# EAGLE design cc2538-dev-v1 (EAGLE 6.5.0)
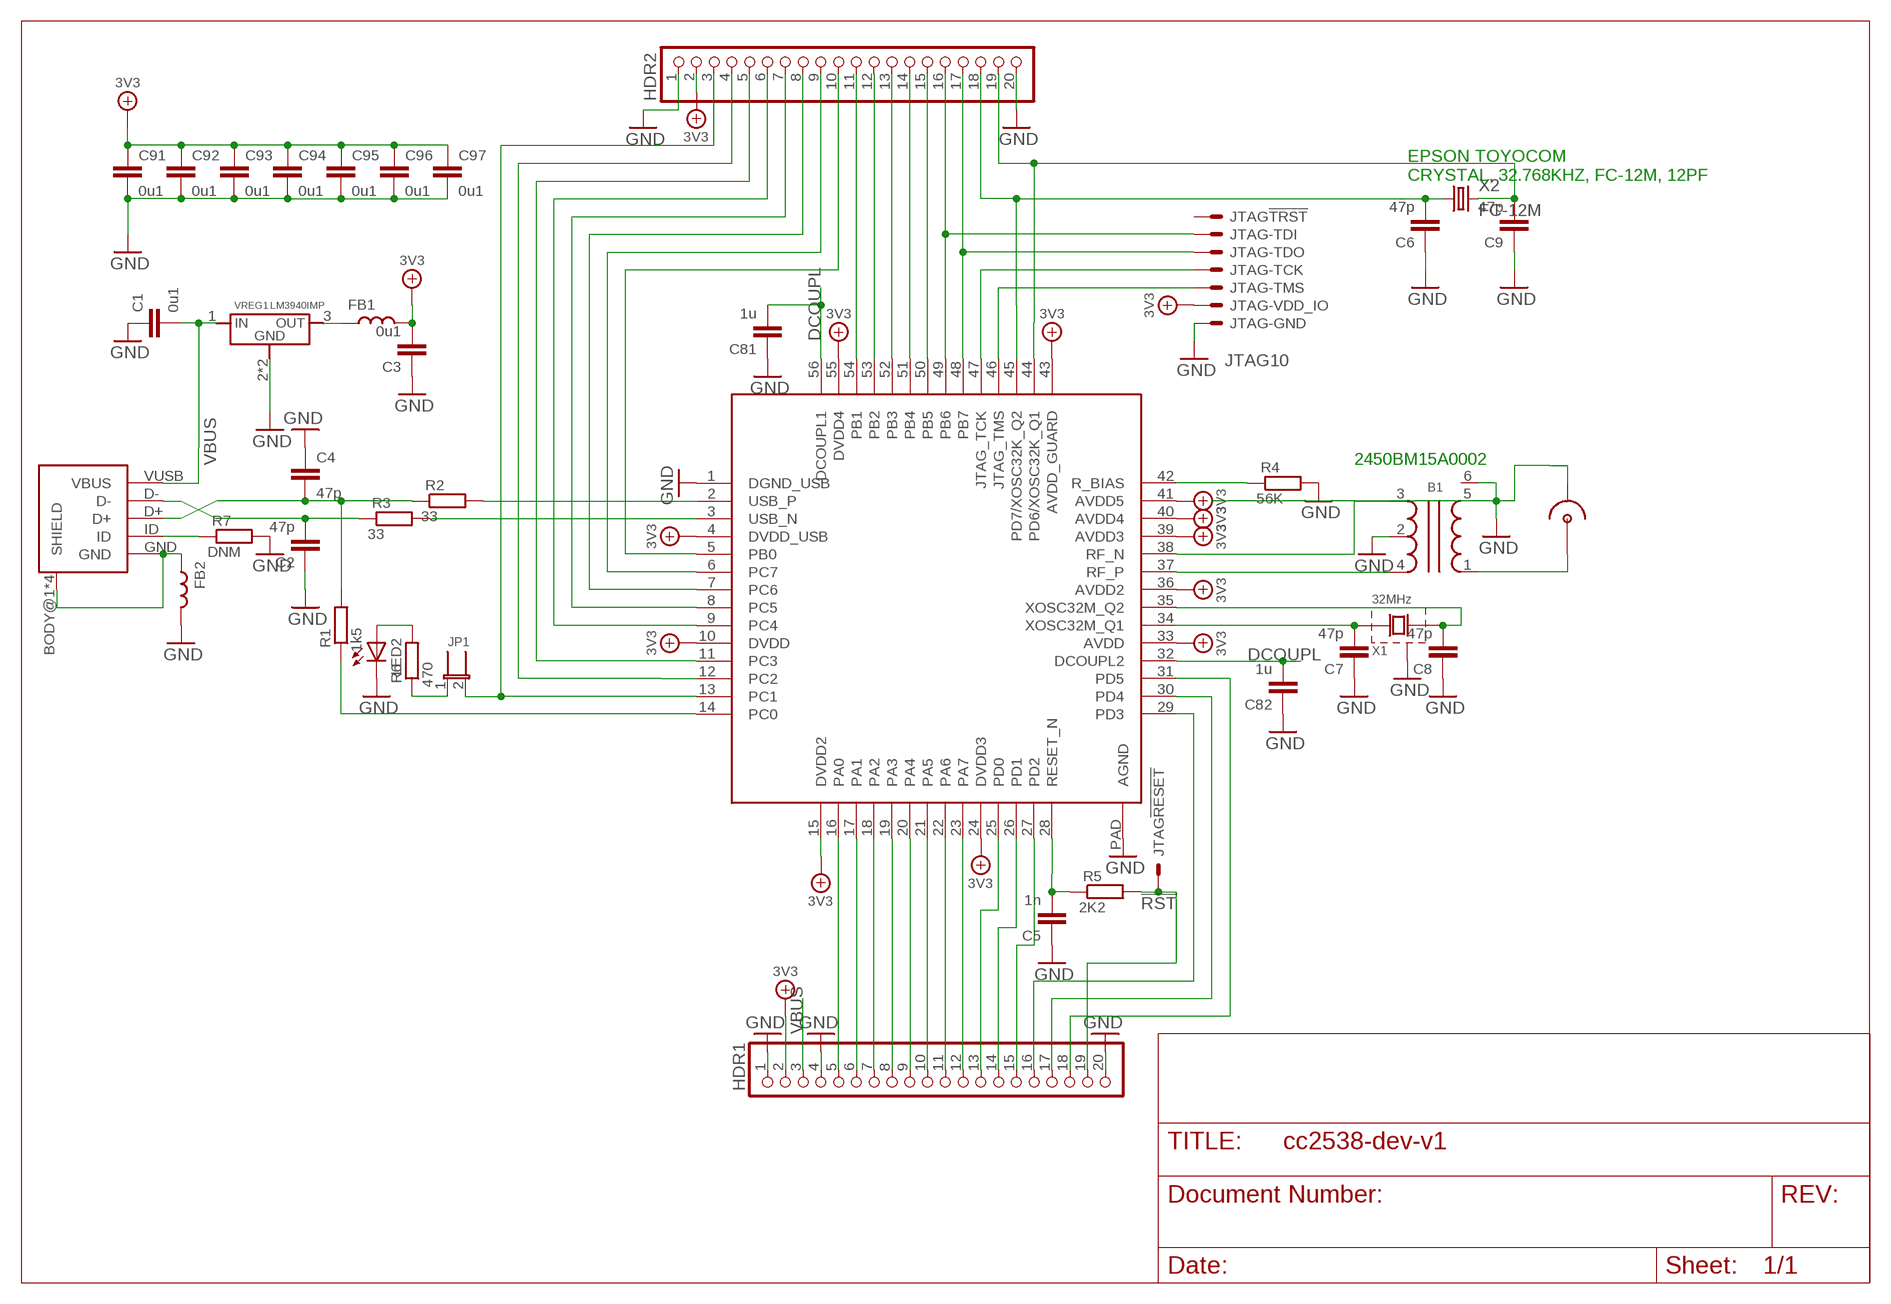
[diagram p0: schematic, sheet 1]

## Parts
B1  BALUN  [BALUN-0805]
C1  0u1  CC1206  [C1206]
C2  47p  CC0603  [C0603]
C3  0u1  CC1206  [C1206]
C4  47p  CC0603  [C0603]
C5  1n  CC0603  [C0603]
C6  47p  CC0603  [C0603]
C7  47p  CC0603  [C0603]
C8  47p  CC0603  [C0603]
C9  47p  CC0603  [C0603]
C81  1u  CC0402  [C0402]
C82  1u  CC0402  [C0402]
C91  0u1  CC0402  [C0402]
C92  0u1  CC0402  [C0402]
C93  0u1  CC0402  [C0402]
C94  0u1  CC0402  [C0402]
C95  0u1  CC0402  [C0402]
C96  0u1  CC0402  [C0402]
C97  0u1  CC0402  [C0402]
CN1  USB-OTG  [CONN_USB_MINI-B]
CN2  RF-CONNSMA  [SMA]
FB1  L0603  [R603]
FB2  L0603  [R603]
HDR1  PINHD-1X20  [1X20]
HDR2  PINHD-1X20  [1X20]
JP1  JP-2MM-2  [JP-2MM-2]
JTAG  JTAG10  [HDR-2X5-2.00]
LED2  LED805  [LED-805]
R1  1k5  RR603  [R603]
R2  33  RR603  [R603]
R3  33  RR603  [R603]
R4  56K  RR603  [R603]
R5  2K2  RR603  [R603]
R6  470  RR603  [R603]
R7  DNM  RR603  [R603]
U1  CC2538  [QFN56]
VREG1  LM3940IMP  [SOT223]
X1  32MHz  XTAL-43225  [XTAL-4-3225]
X2  FC-12M  [FC-12M]

## Nets
3V3: C3.2 C91.1 C92.1 C93.1 C94.1 C95.1 C96.1 C97.1 FB1.2 HDR1.2 HDR2.2 JTAG.1 JTAG.2 U1.4(DVDD_USB) U1.10(DVDD) U1.15(DVDD2) U1.24(DVDD3) U1.33(AVDD) U1.36(AVDD2) U1.39(AVDD3) U1.40(AVDD4) U1.41(AVDD5) U1.43(AVDD_GUARD) U1.55(DVDD4)
!RST: HDR1.19 JTAG.4 R5.2
!RST_PIN: C5.2 R5.1 U1.28(RESET_N)
CN1: C4.2 CN1.D+ R1.2 R2.1
DCOUPL: C81.2 C82.2 U1.32(DCOUPL2) U1.56(DCOUPL1)
GND: B1.2 B1.5 B1.6 C1.1 C2.1 C3.1 C4.1 C5.1 C6.1 C7.1 C8.1 C9.1 C81.1 C82.1 C91.2 C92.2 C93.2 C94.2 C95.2 C96.2 C97.2 CN2.GND1(GND) CN2.GND2(GND) CN2.GND3(GND) CN2.GND4(GND) FB2.2 HDR1.1 HDR1.4 HDR1.20 HDR2.1 HDR2.20 JTAG.8 JTAG.10 LED2.C R4.2 R7.2 U1.1(DGND_USB) U1.PAD(AGND) VREG1.2(GND) VREG1.4(GND) X1.2(GND1) X1.4(GND1)
N$1: R2.2 U1.2(USB_P)
N$2: R3.2 U1.3(USB_N)
N$3: CN1.BODY@1(SHIELD) CN1.BODY@2(SHIELD) CN1.BODY@3(SHIELD) CN1.BODY@4(SHIELD) CN1.GND FB2.1
N$4: R1.1 U1.14(PC0)
N$5: R4.1 U1.42(R_BIAS)
N$6: JTAG.9 U1.47(JTAG_TCK)
N$7: JTAG.7 U1.46(JTAG_TMS)
N$8: HDR1.5 U1.16(PA0)
N$9: HDR1.6 U1.17(PA1)
N$10: HDR1.7 U1.18(PA2)
N$11: HDR1.8 U1.19(PA3)
N$12: C2.2 CN1.D- R3.1
N$13: HDR1.9 U1.20(PA4)
N$14: HDR1.10 U1.21(PA5)
N$15: HDR1.11 U1.22(PA6)
N$16: HDR1.12 U1.23(PA7)
N$17: FB1.1 VREG1.3(OUT)
N$18: HDR2.3 JP1.2 U1.13(PC1)
N$19: HDR2.4 U1.12(PC2)
N$20: HDR2.5 U1.11(PC3)
N$21: HDR1.14 U1.26(PD1)
N$22: HDR1.13 U1.25(PD0)
N$23: C6.2 HDR2.18 U1.45(PD7/XOSC32K_Q2) X2.1
N$24: HDR1.16 U1.29(PD3)
N$25: HDR1.17 U1.30(PD4)
N$26: HDR1.18 U1.31(PD5)
N$27: B1.3 U1.38(RF_N)
N$28: B1.4 U1.37(RF_P)
N$30: C8.2 U1.35(XOSC32M_Q2) X1.3(X2)
N$31: C7.2 U1.34(XOSC32M_Q1) X1.1(X1)
N$32: HDR2.15 U1.50(PB5)
N$33: HDR1.15 U1.27(PD2)
N$34: HDR2.10 U1.5(PB0)
N$35: HDR2.9 U1.6(PC7)
N$36: HDR2.8 U1.7(PC6)
N$37: HDR2.7 U1.8(PC5)
N$38: HDR2.12 U1.53(PB2)
N$39: HDR2.11 U1.54(PB1)
N$40: C9.2 HDR2.19 U1.44(PD6/XOSC32K_Q1) X2.2
N$41: HDR2.14 U1.51(PB4)
N$42: HDR2.6 U1.9(PC4)
N$43: HDR2.13 U1.52(PB3)
N$44: JP1.1 R6.1
N$45: LED2.A R6.2
N$46: CN1.ID R7.1
PB6: HDR2.16 JTAG.5 U1.49(PB6)
PB7: HDR2.17 JTAG.6 U1.48(PB7)
RF: B1.1 CN2.SIG(SIGNAL)
VBUS: C1.2 CN1.VUSB(VBUS) HDR1.3 VREG1.1(IN)
Unconnected: JTAG.3

## Notes on the sheet
- EPSON TOYOCOM
  CRYSTAL, 32.768KHZ, FC-12M, 12PF
- 2450BM15A0002

## Library data of the parts
B1 = discrete:BALUN
C1-C9 C81 C82 C91-C97 = discrete:C: CAPACITOR, European symbol
CN1 = connectors:USB-OTG
CN2 = connectors:RF-CONN: Molex 73415-2121 http://www.molex.com/pdm_docs/sd/734152121_sd.pdf
FB1 FB2 = discrete:L
HDR1 HDR2 = adafruit:PINHD-1X20: PIN HEADER
JP1 = damjan:JP-2MM-2
JTAG = jtag:JTAG10
LED2 = discrete:LED
R1-R7 = discrete:R
U1 = ic:CC2538
VREG1 = voltage-regulators:LM3940
X1 = discrete:XTAL-4
X2 = crystal:FC-12M: kHz RANGE CRYSTAL UNIT LOW PROFILE SMD Source: Epson Toyocom FC-12M.pdf

## Net classes
0 default: width 0.152 mm, drill 0.305 mm, clearance 0.152 mm
1 RF: width 0.152 mm, clearance 0.152 mm

## Board
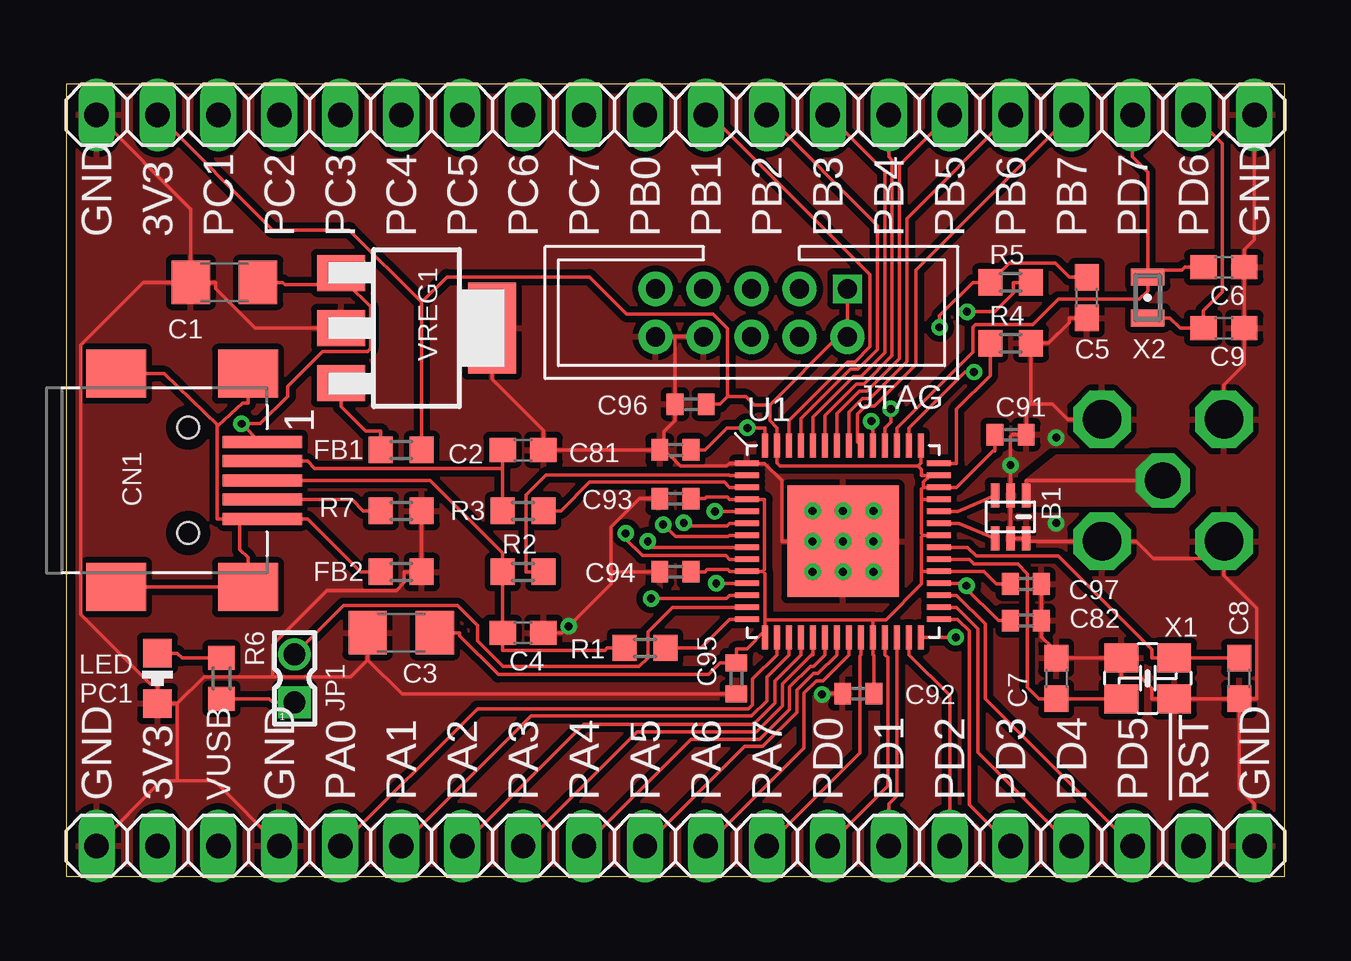
[diagram p1: board, top side]
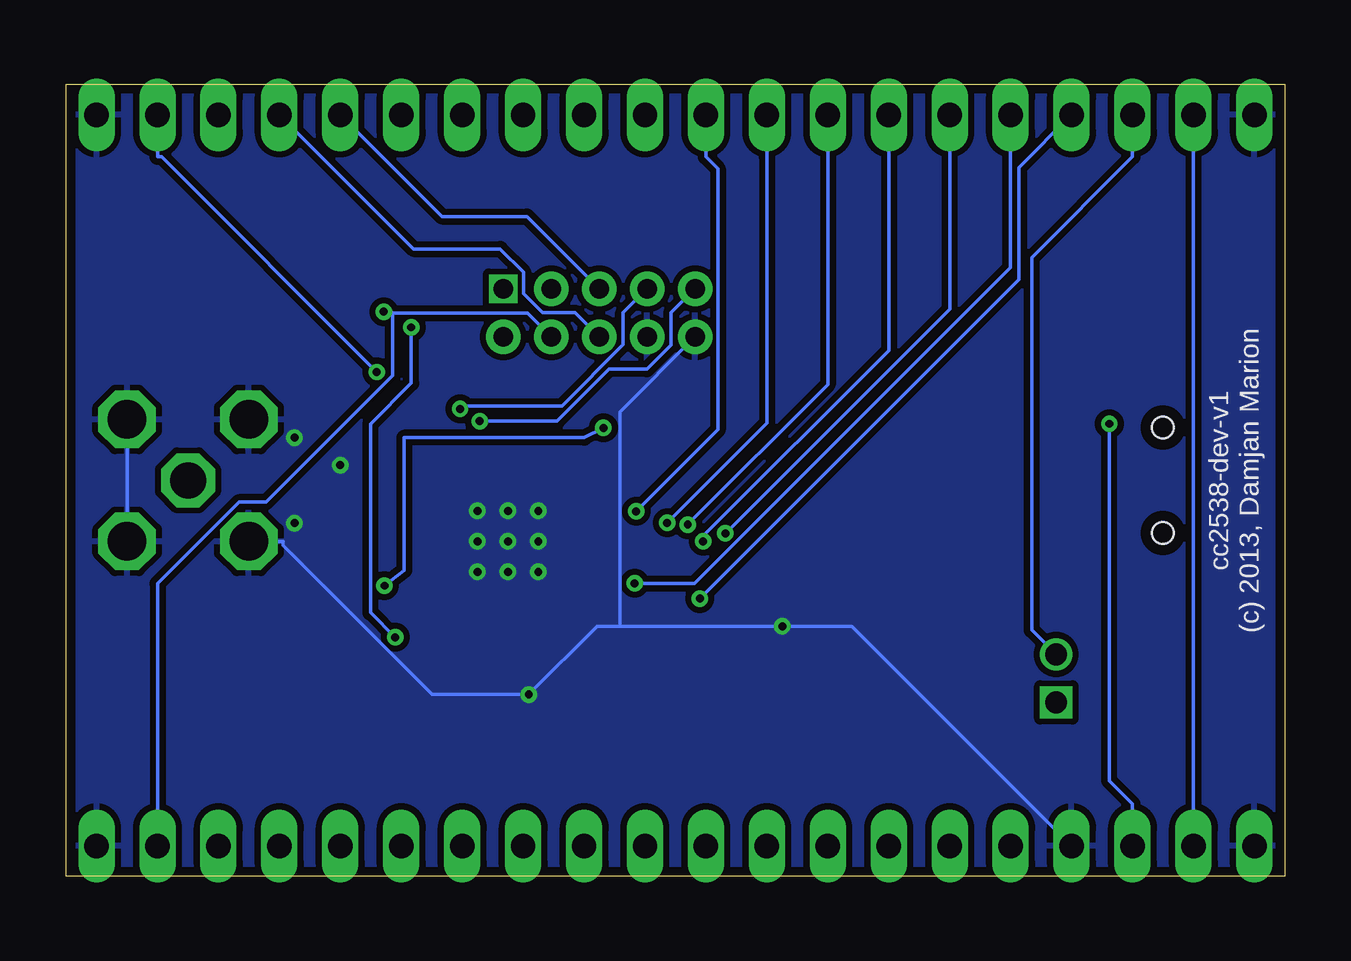
[diagram p2: board, bottom side, seen from below]

Size 50.8 x 33.02 mm. Coordinates in mm from the lower left corner, seen from the top.
Outline: 0,0 50.8,0 50.8,33.02 0,33.02 0,0
Copper layers (1*16): Top 0.0356mm / dielectric 1.5011mm / Bottom 0.0356mm
Design rules "LaenPCBOrder": minimum track width 6mil, minimum drill 13mil, track to track 6mil, track to pad 6mil, pad to pad 6mil, via to via 6mil, smd to smd 6mil, copper to edge 15mil, drill to drill 6mil, minimum pad ring 7mil, minimum via ring 7mil, stop-mask expansion 4mil, vias tented up to drill 0mil, thermal gap 10mil
vRestrict: area 0,3.2 to 50.8,6.3; area 0,26.7 to 50.8,29.8

### Footprints (pad centres in the part's own frame; a part is rotated, then mirrored left to right if it is on the bottom)
BALUN-0805 = smd 1 x 0.35: 1 -0.9,0.65; 2 -0.9,0; 3 -0.9,-0.65; 4 0.9,-0.65; 5 0.9,0; 6 0.9,0.65
C1206 = smd 1.6 x 1.8: 1 -1.4,0; 2 1.4,0
C0603 = smd 1.1 x 1: 1 -0.85,0; 2 0.85,0
C0402 = smd 0.7 x 0.9: 1 -0.65,0; 2 0.65,0
CONN_USB_MINI-B = smd 2 x 2.5: BODY@1 -4.45,2.5; BODY@2 4.45,2.5; BODY@3 4.45,-3; BODY@4 -4.45,-3 | smd 0.5 x 3.3: D+ 0,3.1; D- -0.8,3.1; GND 1.6,3.1; ID 0.8,3.1; VUSB -1.6,3.1 | hole 0.9: -2.2,0; 2.2,0
SMA = drill 1.6 octagon: GND1 -2.54,2.54; GND2 2.54,2.54; GND3 2.54,-2.54; GND4 -2.54,-2.54 | drill 1.5 octagon: SIG 0,0
R603 = smd 1 x 1.1: 1 -0.85,0; 2 0.85,0
1X20 = drill 1.016 long: 1 -24.13,0; 2 -21.59,0; 3 -19.05,0; 4 -16.51,0; 5 -13.97,0; 6 -11.43,0; 7 -8.89,0; 8 -6.35,0; 9 -3.81,0; 10 -1.27,0; 11 1.27,0; 12 3.81,0; 13 6.35,0; 14 8.89,0; 15 11.43,0; 16 13.97,0; 17 16.51,0; 18 19.05,0; 19 21.59,0; 20 24.13,0
JP-2MM-2 = drill 0.9 pad 1.27 square: 1 0,-1 | drill 0.9 pad 1.27: 2 0,1
HDR-2X5-2.00 = drill 0.8 square: 1 -4,-1 | drill 0.8 pad 1.422: 2 -4,1; 3 -2,-1; 4 -2,1; 5 0,-1; 6 0,1; 7 2,-1; 8 2,1; 9 4,-1; 10 4,1
LED-805 = smd 1.2 x 1.2: A 0,-1.05; C 0,1.05
QFN56 = smd 1 x 0.24: 1 -4,3.25; 2 -4,2.75; 3 -4,2.25; 4 -4,1.75; 5 -4,1.25; 6 -4,0.75; 7 -4,0.25; 8 -4,-0.25; 9 -4,-0.75; 10 -4,-1.25; 11 -4,-1.75; 12 -4,-2.25; 13 -4,-2.75; 14 -4,-3.25; 29 4,-3.25; 30 4,-2.75; 31 4,-2.25; 32 4,-1.75; 33 4,-1.25; 34 4,-0.75; 35 4,-0.25; 36 4,0.25; 37 4,0.75; 38 4,1.25; 39 4,1.75; 40 4,2.25; 41 4,2.75; 42 4,3.25 | smd 0.24 x 1: 15 -3.25,-4; 16 -2.75,-4; 17 -2.25,-4; 18 -1.75,-4; 19 -1.25,-4; 20 -0.75,-4; 21 -0.25,-4; 22 0.25,-4; 23 0.75,-4; 24 1.25,-4; 25 1.75,-4; 26 2.25,-4; 27 2.75,-4; 28 3.25,-4; 43 3.25,4; 44 2.75,4; 45 2.25,4; 46 1.75,4; 47 1.25,4; 48 0.75,4; 49 0.25,4; 50 -0.25,4; 51 -0.75,4; 52 -1.25,4; 53 -1.75,4; 54 -2.25,4; 55 -2.75,4; 56 -3.25,4 | smd 4.65 x 4.65: PAD 0,0
SOT223 = smd 1.5 x 2: 1 -2.3,-3.15; 2 0,-3.15; 3 2.3,-3.15 | smd 3.8 x 2: 4 0,3.15
XTAL-4-3225 = smd 1.4 x 1.2: 1 -1.1,-0.85; 2 1.1,-0.85; 3 1.1,0.85; 4 -1.1,0.85
FC-12M = smd 0.7 x 1.4: 1 -0.85,0; 2 0.85,0

### Placement (x,y rotation side)
B1  39.37,14.99 270 top
C1  6.6,24.77 0 top
C2  19.05,17.78 180 top
C3  13.97,10.16 0 top
C4  19.05,10.16 180 top
C5  42.55,24.13 90 top
C6  48.26,25.4 180 top
C7  41.27,8.26 270 top
C8  48.9,8.26 90 top
C9  48.26,22.86 180 top
C81  25.4,17.78 0 top
C82  40.01,10.67 180 top
C91  39.37,18.41 0 top
C92  33.02,7.62 180 top
C93  25.4,15.75 180 top
C94  25.4,12.7 180 top
C95  27.94,8.26 270 top
C96  26.04,19.68 180 top
C97  40.01,12.19 0 top
CN1  5.08,16.51 270 top
CN2  45.72,16.51 0 top
FB1  13.97,17.78 0 top
FB2  13.97,12.7 0 top
HDR1  25.4,1.27 0 top
HDR2  25.4,31.75 0 top
JP1  9.53,8.26 0 top
JTAG  28.57,23.5 180 top
LED2  3.81,8.26 180 top
R1  24.13,9.53 180 top
R2  19.05,12.7 0 top
R3  19.05,15.24 0 top
R4  39.37,22.23 0 top
R5  39.37,24.77 0 top
R6  6.48,8.26 90 top
R7  13.97,15.24 0 top
U1  32.38,13.97 0 top
VREG1  14.61,22.86 270 top
X1  45.09,8.26 0 top
X2  45.09,24.13 270 top

### Tracks (layer width: path | path; a pad name or v marks a point on that pad's centre or on a via)
3V3
  Top 0.152: 36.02,16.72 35.73,16.43 35.73,16.22 | 35.73,16.22 35.66,16.14 35.66,15.72 | 35.73,16.22 U1.40 37.11,16.22 38.63,17.74 38.72,17.74 C91.1 | 36.02,16.72 35.66,16.72 35.66,16.97 35.51,17.12 | U1.41 36.02,16.72 | 35.51,17.12 29.76,17.12 29.64,17.24 29.64,17.61 U1.55 29.64,18.7 29.33,19 29.33,19.64 | 35.51,17.12 35.63,17.24 U1.43 | 29.33,19.64 32.18,22.5 JTAG.2 JTAG.1 | 29.33,19.64 28.69,19.64 28.34,20 27.57,20 | 27.57,20 27.26,19.68 C96.1 | 14.82,23.93 15.88,24.99 21.82,24.99 23.37,23.43 26.97,23.43 27.57,22.83 27.57,20 | 29.04,12.72 29.14,12.62 29.14,10.7 | 29.04,12.72 29.11,12.8 29.11,15.72 U1.4 27.66,15.72 27.56,15.82 26.7,15.82 26.63,15.75 26.07,15.75 C93.1 | 29.14,10.25 28.37,9.48 27.94,9.48 C95.1 27.26,8.9 26.77,8.41 18.02,8.41 16.4,10.03 16.4,10.16 C3.2 | 29.14,10.25 29.14,10.7 | U1.15 29.14,10.25 | 33.63,10.7 29.14,10.7 | 33.63,10.7 33.63,10.62 U1.24 33.63,9.24 33.67,9.21 C92.1 | C97.1 38.78,12.19 38.25,12.72 U1.33 35.66,12.72 | 33.63,10.7 34.17,10.7 35.66,12.19 35.66,12.72 | 35.66,15.72 35.66,14.3 35.73,14.22 | 35.73,14.22 35.66,14.14 35.66,12.72 | 14.82,23.93 FB1.2 | HDR2.2 8.61,26.95 11.8,26.95 14.82,23.93 | 29.04,12.72 U1.10 27.66,12.72 27.59,12.79 26.72,12.79 26.63,12.7 26.34,12.7 C94.1 | U1.39 35.66,15.72 | U1.36 35.73,14.22
  Bottom 0.152: HDR2.2 HDR1.2
!RST  (via drill 0.33 pad 0.69)
  Top 0.152: v37.56,23.54 38.72,23.54 39.49,24.31 39.49,24.77 R5.2
  Bottom 0.152: 37.19,23.47 37.25,23.54 v37.56,23.54 | 37.19,23.47 37.19,20.88 42.46,15.6 43.59,15.6 46.99,12.21 HDR1.19 | 37.19,23.47 31.55,23.47 JTAG.4
!RST_PIN  (via drill 0.33 pad 0.69)
  Top 0.152: U1.28 v37.08,9.97 | v36.41,22.89 36.41,23.38 37.79,24.77 R5.1 39.32,25.57 41.23,25.57 41.82,24.98 C5.2
  Bottom 0.152: v37.08,9.97 38.11,11 38.11,18.86 36.41,20.56 v36.41,22.89
CN1
  Top 0.152: CN1.D+ 15.17,16.51 18.2,13.48 R2.1 C4.2 18.2,9.8 18.2,9.43 22.46,9.43 22.55,9.53 R1.2
DCOUPL  (via drill 0.33 pad 0.69)
  Top 0.152: 37.47,12.06 v37.53,12.12 | 37.47,12.06 37.3,12.22 37.11,12.22 U1.32 | 37.47,12.06 38.85,10.67 C82.2 | U1.56 29.14,18.7 v28.4,18.7 27.55,18.7 26.63,17.78 C81.2
  Bottom 0.152: v28.4,18.7 29.21,18.29 36.7,18.29 36.7,12.76 v37.53,12.12 | v37.53,12.12
GND  (via drill 0.33 pad 0.69)
  Top 0.152: CN2.GND2 48.26,20.48 49.11,21.33 C9.1 C6.1 49.11,26.13 49.53,26.55 HDR2.20 | C92.2 31.79,7.62 31.75,7.58 v31.51,7.58 | U1.PAD 29.83,13.97 29.83,16.5 29.11,17.22 U1.1 27.66,17.22 27.54,17.1 25.6,17.1 24.92,17.78 | 22.71,12.7 22.71,14.56 23.9,15.75 24.17,15.75 C93.2 | C1.1 3.21,24.77 0.6,22.15 0.6,10.93 3.5,8.03 3.81,8.03 LED2.C 4.64,7.21 | C1.1 5.72,24.77 6.23,24.77 6.23,24.51 7.88,22.86 10.23,22.86 VREG1.2 | 4.64,3.98 3.98,3.98 HDR1.1 | HDR1.4 6.18,3.98 4.64,3.98 | 4.64,3.98 4.64,7.21 | 24.92,17.78 24.92,18.54 25.39,19.01 C96.2 25.39,22.5 | 22.71,12.7 C94.2 | 22.71,12.7 22.71,12.19 v20.95,10.43 20.68,10.16 C4.1 | 24.92,17.78 24.84,17.78 C81.1 C2.1 19.9,18.59 17.75,20.73 VREG1.4 | 25.39,22.5 JTAG.10 | JTAG.8 25.39,22.5 | 8.6,8.32 5.76,8.32 4.64,7.21 | 12.57,9.03 14,7.61 27.26,7.61 C95.2 | 40.22,19.69 41.12,19.69 41.75,19.05 CN2.GND1 | 40.22,19.69 40.22,21.45 R4.2 40.95,22.23 41.82,23.09 41.82,23.28 C5.1 | 40.22,19.69 40.02,19.49 C91.2 39.44,18.41 39.37,18.34 B1.2 B1.5 B1.6 40.14,13.97 CN2.GND4 44.61,13.97 45.32,13.26 48.26,13.26 | 48.26,13.26 48.26,12.54 49.62,11.18 49.62,7.41 C8.1 | CN2.GND3 48.26,13.26 | 8.6,8.32 8.6,9.65 10.88,11.92 13.77,11.92 14.09,12.24 14.09,12.7 FB2.2 R7.2 | 8.6,8.32 11.86,8.32 12.57,9.03 | C8.1 X1.2 45.26,7.41 45.26,7.83 44.81,8.28 43.98,8.28 X1.4 43.06,9.11 | C7.1 41.27,9.49 41.15,9.49 40.66,9.99 C82.1 C97.2 | C7.1 | 43.06,9.11 | 43.06,9.11 C7.1 | HDR1.20 49.53,3.02 48.9,3.66 C8.1 | C3.1 12.57,9.03 | C1.1 5.2,27.82 HDR2.1
  Bottom 0.152: CN2.GND4 41.75,13.97 41.75,13.79 35.54,7.58 v31.51,7.58 28.66,10.43 27.71,10.43 | 27.71,10.43 v20.95,10.43 18.05,10.43 HDR1.4 | JTAG.10 27.71,19.36 27.71,10.43 | CN2.GND3 CN2.GND2
  other vias: 32.38,13.97 31.11,13.97 31.11,15.24 32.38,15.24 33.66,15.24 33.66,13.97 33.66,12.7 32.38,12.7 31.11,12.7 39.37,17.14 41.27,14.73 41.27,18.29
  pour Bottom (isolate 0.254): 0,0 50.8,0 50.8,33.02 0,33.02
  pour Top (isolate 0.254, rank 2): 0,0 50.8,0 50.8,33.02 0,33.02
N$1
  Top 0.152: R2.2 19.17,12.7 19.17,15.89 20.02,16.74 27.64,16.74 27.66,16.72 U1.2
N$2
  Top 0.152: R3.2 20.63,15.24 21.82,16.43 27.44,16.43 27.66,16.22 U1.3
N$3
  Top 0.152: 7.24,14.91 7.24,13.63 7.58,13.29 CN1.BODY@2 CN1.BODY@3 | 7.24,14.91 6.3,14.91 6.3,18.8 6.34,18.8 | 7.24,14.91 CN1.GND 10.06,14.91 12.27,12.7 FB2.1 | 6.34,18.8 7.36,19.73 7.58,19.73 CN1.BODY@1 | 6.34,18.8 4.09,20.96 3.56,20.96 CN1.BODY@4
N$4
  Top 0.152: U1.14 27.66,10.72 26.46,9.53 25.71,9.53 R1.1
N$5
  Top 0.152: R4.1 38.52,21.45 38.52,20.89 37.11,19.48 37.11,17.22 U1.42
N$6  (via drill 0.33 pad 0.69)
  Top 0.152: v33.56,18.98 33.56,18.77 33.63,18.7 U1.47
  Bottom 0.152: JTAG.9 25.57,23.5 25.57,22.16 26.59,21.15 28.16,21.15 30.33,18.98 v33.56,18.98
N$7  (via drill 0.33 pad 0.69)
  Top 0.152: v34.38,19.49 34.38,18.94 34.13,18.7 U1.46 | v34.38,19.49
  Bottom 0.152: v34.38,19.49 34.25,19.62 30.12,19.62 27.57,22.16 27.57,23.5 JTAG.7
N$8
  Top 0.152: U1.16 29.64,9.24 28.62,8.22 28.62,7.16 28.45,6.99 17.15,6.99 HDR1.5
N$9
  Top 0.152: U1.17 30.14,9.24 29.21,8.31 29.21,7.32 28.57,6.68 19.38,6.68 HDR1.6
N$10
  Top 0.152: HDR1.7 21.57,6.33 28.65,6.33 29.55,7.22 29.55,8.15 30.64,9.24 U1.18
N$11
  Top 0.152: HDR1.8 23.8,6.02 28.78,6.02 29.85,7.1 29.85,8.02 31.07,9.24 31.14,9.24 U1.19
N$12
  Top 0.152: R3.1 18.2,17.05 | C2.2 18.2,17.05 | CN1.D- 10.06,17.31 10.37,17 18.15,17 18.2,17.05
N$13
  Top 0.152: HDR1.9 26.04,5.72 28.9,5.72 30.16,6.97 30.16,7.89 31.02,8.76 31.16,8.76 31.64,9.24 U1.20
N$14
  Top 0.152: HDR1.10 28.27,5.41 29.03,5.41 30.46,6.85 30.46,7.77 31.15,8.46 31.35,8.46 32.13,9.24 U1.21
N$15
  Top 0.152: HDR1.11 30.77,5.37 30.77,7.64 31.28,8.15 31.55,8.15 32.63,9.24 U1.22
N$16
  Top 0.152: U1.23 33.13,9.24 33.09,9.2 33.09,5.15 HDR1.12
N$17
  Top 0.152: FB1.1 13.12,18.56 12.48,18.56 11.46,19.58 VREG1.3
N$18
  Top 0.152: JP1.2 11.56,11.29 16.32,11.29 17.15,10.46 17.15,9.81 18.22,8.75 23.89,8.75 24.25,9.11 24.25,10.19 25.28,11.22 27.66,11.22 U1.13
  Bottom 0.152: HDR2.3 6.35,30 10.54,25.8 10.54,10.27 JP1.2
N$19  (via drill 0.33 pad 0.69)
  Top 0.152: U1.12 27.66,11.72 27.52,11.59 v24.38,11.59
  Bottom 0.152: HDR2.4 11.1,29.55 11.1,24.88 v24.38,11.59
N$20  (via drill 0.33 pad 0.69)
  Top 0.152: U1.11 v27.1,12.22
  Bottom 0.152: v27.1,12.22 24.6,12.22 11.43,25.39 HDR2.5
N$21
  Top 0.152: HDR1.14 34.29,3.02 34.63,3.37 U1.26
N$22
  Top 0.152: U1.25 34.13,9.24 34.25,9.13 34.25,3.77 HDR1.13
N$23
  Top 0.152: HDR2.18 44.45,30 45.09,29.36 45.09,25.27 | 45.09,25.27 46.5,25.27 46.63,25.4 C6.2 | U1.45 34.63,18.7 37.79,21.85 37.79,22.89 37.91,23.01 40.31,23.01 41.35,24.06 44.74,24.06 45.09,24.4 X2.1 45.09,25.27
N$24
  Top 0.152: U1.29 37.16,10.72 37.65,10.23 37.65,2.99 HDR1.16
N$25
  Top 0.152: HDR1.17 38.01,5.17 38.01,10.32 37.11,11.22 U1.30
N$26
  Top 0.152: HDR1.18 38.31,7.41 38.31,10.52 37.11,11.72 U1.31
N$27
  Top 0.152: B1.3 37.18,15.22 37.11,15.22 U1.38
N$28
  Top 0.152: B1.4 37.21,14.72 37.11,14.72 U1.37
N$30
  Top 0.152: U1.35 37.58,13.72 37.94,13.36 41.37,13.36 45.26,9.47 45.26,9.11 X1.3 C8.2
N$31
  Top 0.152: U1.34 37.64,13.22 37.84,13.03 39.67,13.03 40.08,12.62 40.08,7.88 40.55,7.41 C7.2 43.06,7.41 X1.1
N$32
  Top 0.152: HDR2.15 34.73,29.66 34.73,21.58 33.38,20.23 33.07,20.23 32.13,19.29 U1.50
N$33
  Top 0.152: HDR1.15 36.83,7.55 35.13,9.24 U1.27
N$34  (via drill 0.33 pad 0.69)
  Top 0.152: U1.5 v27.04,15.22
  Bottom 0.152: v27.04,15.22 23.64,18.62 23.64,29.5 24.13,30 HDR2.10
N$35  (via drill 0.33 pad 0.69)
  Top 0.152: v25.75,14.74 25.87,14.62 27.55,14.62 27.66,14.72 U1.6
  Bottom 0.152: 21.59,30 | 21.59,30 21.59,18.9 v25.75,14.74 | HDR2.9 21.59,30
N$36  (via drill 0.33 pad 0.69)
  Top 0.152: v24.89,14.67 25.39,14.16 27.6,14.16 27.66,14.22 U1.7
  Bottom 0.152: HDR2.8 19.05,20.51 v24.89,14.67
N$37  (via drill 0.33 pad 0.69)
  Top 0.152: U1.8 24.5,13.72 v24.24,13.97
  Bottom 0.152: HDR2.7 16.51,21.92 | 16.51,21.92 | 16.51,21.92 24.24,14.19 v24.24,13.97
N$38
  Top 0.152: HDR2.12 33.82,27.14 33.82,21.96 33,21.14 32.7,21.14 30.64,19.08 U1.53
N$39
  Top 0.152: HDR2.11 26.84,31.75 33.52,25.08 33.52,22.09 32.88,21.45 32.57,21.45 30.14,19.02 U1.54
N$40  (via drill 0.33 pad 0.69)
  Top 0.152: X2.2 46.01,23.28 46.43,22.86 C9.2 47.41,23.59 48.19,24.37 48.19,30.55 HDR2.19 | U1.44 35.13,18.7 37.46,21.03 v37.85,21.03
  Bottom 0.152: HDR2.19 46.99,30 46.82,30 v37.85,21.03
N$41
  Top 0.152: U1.51 31.64,19.22 32.95,20.53 33.26,20.53 34.43,21.71 34.43,29.86 34.29,30 HDR2.14
N$42  (via drill 0.33 pad 0.69)
  Top 0.152: v23.32,14.3 23.32,14.08 24.02,13.38 27.5,13.38 27.66,13.22 U1.9
  Bottom 0.152: v23.32,14.3 13.97,23.66 HDR2.6
N$43
  Top 0.152: HDR2.13 34.12,29.38 34.12,21.83 33.13,20.84 32.82,20.84 31.14,19.15 U1.52
N$44
  Top 0.152: JP1.1 8.62,7.25 8.47,7.41 R6.1
N$45
  Top 0.152: LED2.A 4.64,9.3 4.84,9.11 R6.2
N$46
  Top 0.152: R7.1 12.39,15.24 11.92,15.71 CN1.ID
PB6
  Top 0.152: U1.49 32.63,18.7 32.63,19.36 33.2,19.92 33.51,19.92 35.04,21.45 35.04,27.42 HDR2.16
  Bottom 0.152: HDR2.16 35.13,27.51 31.59,27.51 JTAG.5
PB7
  Top 0.152: HDR2.17 35.43,25.27 35.43,21.35 33.7,19.62 33.33,19.62 32.99,19.28 32.99,18.11 U1.48
  Bottom 0.152: HDR2.17 36.31,26.15 32.7,26.15 31.74,25.19 31.74,24.3 30.93,23.5 29.57,23.5 JTAG.6
RF
  Top 0.152: CN2.SIG 44.37,16.51 44.26,16.51 40.02,16.51 B1.1
  pour Top (no thermals): 45.21,17.53 45.21,15.49 40.01,15.49 40.01,16.51 41.27,17.53
VBUS  (via drill 0.33 pad 0.69)
  Top 0.152: 11.46,24.67 11.76,24.67 12.68,23.75 12.68,22 12.57,21.88 10.7,21.88 9.24,20.42 9.24,20.01 8.1,18.87 v7.32,18.87 8.08,18.11 CN1.VUSB | 11.46,24.67 9.13,24.67 9.03,24.77 C1.2 | VREG1.1 11.46,24.67
  Bottom 0.152: HDR1.3 6.35,3.02 7.32,3.99 v7.32,18.87 | v7.32,18.87

### Text on the board
tNames: GND | 3V3 | PC1 | PC2 | PC3 | PC4 | PC5 | PC6 | PC7 | PB0 | PB1 | PB2 | PB3 | PB4 | PB5 | PB6 | PB7 | PD7 | PD6 | GND | LED / PC1 | GND | 3V3 | VUSB | GND | PA0 | PA1 | PA2 | PA3 | PA4 | PA5 | PA6 | PA7 | PD0 | PD1 | PD2 | PD3 | PD4 | PD5 | !RST | GND
bNames: (c) 2013, Damjan Marion | cc2538-dev-v1